# Altium schematic sheet Main.SchDoc
size A4
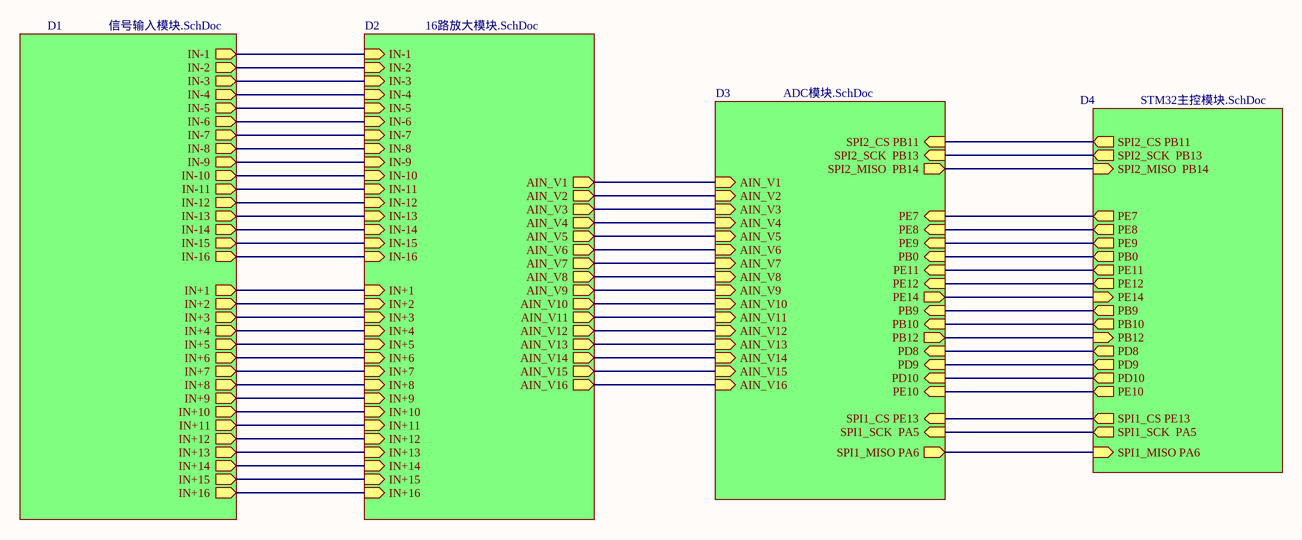
[diagram p0: Main.SchDoc]

## Sub-sheets
D1 = 信号输入模块.SchDoc: IN-2 (out), IN-3 (out), IN-4 (out), IN-5 (out), IN-6 (out), IN-7 (out), IN-8 (out), IN-9 (out), IN-10 (out), IN-11 (out), IN-12 (out), IN-13 (out), IN-14 (out), IN-15 (out), IN-16 (out), IN+1 (out), IN+2 (out), IN+3 (out), IN+5 (out), IN+4 (out), IN+6 (out), IN+7 (out), IN+8 (out), IN+9 (out), IN+10 (out), IN+11 (out), IN+12 (out), IN+13 (out), IN+14 (out), IN+15 (out), IN+16 (out), IN-1 (out)
D2 = 16路放大模块.SchDoc: IN-1 (in), IN-2 (in), IN-3 (in), IN-4 (in), IN-5 (in), IN-6 (in), IN-7 (in), IN-8 (in), IN-9 (in), IN-10 (in), IN-11 (in), IN-12 (in), IN-13 (in), IN-14 (in), IN-15 (in), IN-16 (in), IN+1 (in), IN+2 (in), IN+3 (in), IN+5 (in), IN+4 (in), IN+6 (in), IN+7 (in), IN+8 (in), IN+9 (in), IN+10 (in), IN+11 (in), IN+12 (in), IN+13 (in), IN+14 (in), IN+15 (in), IN+16 (in), AIN_V1 (out), AIN_V2 (out), AIN_V3 (out), AIN_V4 (out), AIN_V5 (out), AIN_V6 (out), AIN_V7 (out), AIN_V8 (out), AIN_V9 (out), AIN_V10 (out), AIN_V11 (out), AIN_V12 (out), AIN_V13 (out), AIN_V14 (out), AIN_V15 (out), AIN_V16 (out)
D3 = ADC模块.SchDoc: AIN_V1 (in), AIN_V2 (in), AIN_V3 (in), AIN_V4 (in), AIN_V5 (in), AIN_V6 (in), AIN_V7 (in), AIN_V8 (in), AIN_V9 (in), AIN_V10 (in), AIN_V11 (in), AIN_V12 (in), AIN_V13 (in), AIN_V14 (in), AIN_V15 (in), AIN_V16 (in), PE7 (in), PE8 (in), PE9 (in), PB0 (in), PE11 (in), PE12 (in), PE14 (out), SPI1_CS PE13 (in), SPI1_SCK  PA5 (in), SPI1_MISO PA6 (out), SPI2_CS PB11 (in), SPI2_SCK  PB13 (in), SPI2_MISO  PB14 (out), PB9 (in), PB10 (in), PB12 (out), PD8 (in), PD9 (in), PD10 (in), PE10 (in)
D4 = STM32主控模块.SchDoc: PE7 (out), PE8 (out), PE9 (out), PB0 (out), PE11 (out), PE12 (out), PE14 (in), SPI1_CS PE13 (out), SPI1_SCK  PA5 (out), SPI1_MISO PA6 (in), SPI2_CS PB11 (out), SPI2_SCK  PB13 (out), SPI2_MISO  PB14 (in), PB9 (out), PB10 (out), PB12 (in), PD8 (out), PD9 (out), PD10 (out), PE10 (out)

## Nets
(unnamed): sheet D4/PE7, sheet D3/PE7
(unnamed): sheet D4/PE8, sheet D3/PE8
(unnamed): sheet D4/PE9, sheet D3/PE9
(unnamed): sheet D4/PB0, sheet D3/PB0
(unnamed): sheet D4/PE11, sheet D3/PE11
(unnamed): sheet D4/PE12, sheet D3/PE12
(unnamed): sheet D4/PE14, sheet D3/PE14
(unnamed): sheet D4/SPI1_CS PE13, sheet D3/SPI1_CS PE13
(unnamed): sheet D4/SPI1_SCK  PA5, sheet D3/SPI1_SCK  PA5
(unnamed): sheet D4/SPI1_MISO PA6, sheet D3/SPI1_MISO PA6
(unnamed): sheet D4/SPI2_CS PB11, sheet D3/SPI2_CS PB11
(unnamed): sheet D4/SPI2_SCK  PB13, sheet D3/SPI2_SCK  PB13
(unnamed): sheet D4/SPI2_MISO  PB14, sheet D3/SPI2_MISO  PB14
(unnamed): sheet D4/PB9, sheet D3/PB9
(unnamed): sheet D4/PB10, sheet D3/PB10
(unnamed): sheet D4/PB12, sheet D3/PB12
(unnamed): sheet D4/PD8, sheet D3/PD8
(unnamed): sheet D4/PD9, sheet D3/PD9
(unnamed): sheet D4/PD10, sheet D3/PD10
(unnamed): sheet D4/PE10, sheet D3/PE10
(unnamed): sheet D2/IN-1, sheet D1/IN-1
(unnamed): sheet D2/IN-2, sheet D1/IN-2
(unnamed): sheet D2/IN-3, sheet D1/IN-3
(unnamed): sheet D2/IN-4, sheet D1/IN-4
(unnamed): sheet D2/IN-5, sheet D1/IN-5
(unnamed): sheet D2/IN-6, sheet D1/IN-6
(unnamed): sheet D2/IN-7, sheet D1/IN-7
(unnamed): sheet D2/IN-8, sheet D1/IN-8
(unnamed): sheet D2/IN-9, sheet D1/IN-9
(unnamed): sheet D2/IN-10, sheet D1/IN-10
(unnamed): sheet D2/IN-11, sheet D1/IN-11
(unnamed): sheet D2/IN-12, sheet D1/IN-12
(unnamed): sheet D2/IN-13, sheet D1/IN-13
(unnamed): sheet D2/IN-14, sheet D1/IN-14
(unnamed): sheet D2/IN-15, sheet D1/IN-15
(unnamed): sheet D2/IN-16, sheet D1/IN-16
(unnamed): sheet D2/IN+1, sheet D1/IN+1
(unnamed): sheet D2/IN+2, sheet D1/IN+2
(unnamed): sheet D2/IN+3, sheet D1/IN+3
(unnamed): sheet D2/IN+5, sheet D1/IN+5
(unnamed): sheet D2/IN+4, sheet D1/IN+4
(unnamed): sheet D2/IN+6, sheet D1/IN+6
(unnamed): sheet D2/IN+7, sheet D1/IN+7
(unnamed): sheet D2/IN+8, sheet D1/IN+8
(unnamed): sheet D2/IN+9, sheet D1/IN+9
(unnamed): sheet D2/IN+10, sheet D1/IN+10
(unnamed): sheet D2/IN+11, sheet D1/IN+11
(unnamed): sheet D2/IN+12, sheet D1/IN+12
(unnamed): sheet D2/IN+13, sheet D1/IN+13
(unnamed): sheet D2/IN+14, sheet D1/IN+14
(unnamed): sheet D2/IN+15, sheet D1/IN+15
(unnamed): sheet D2/IN+16, sheet D1/IN+16
(unnamed): sheet D2/AIN_V1, sheet D3/AIN_V1
(unnamed): sheet D2/AIN_V2, sheet D3/AIN_V2
(unnamed): sheet D2/AIN_V3, sheet D3/AIN_V3
(unnamed): sheet D2/AIN_V4, sheet D3/AIN_V4
(unnamed): sheet D2/AIN_V5, sheet D3/AIN_V5
(unnamed): sheet D2/AIN_V6, sheet D3/AIN_V6
(unnamed): sheet D2/AIN_V7, sheet D3/AIN_V7
(unnamed): sheet D2/AIN_V8, sheet D3/AIN_V8
(unnamed): sheet D2/AIN_V9, sheet D3/AIN_V9
(unnamed): sheet D2/AIN_V10, sheet D3/AIN_V10
(unnamed): sheet D2/AIN_V11, sheet D3/AIN_V11
(unnamed): sheet D2/AIN_V12, sheet D3/AIN_V12
(unnamed): sheet D2/AIN_V13, sheet D3/AIN_V13
(unnamed): sheet D2/AIN_V14, sheet D3/AIN_V14
(unnamed): sheet D2/AIN_V15, sheet D3/AIN_V15
(unnamed): sheet D2/AIN_V16, sheet D3/AIN_V16